# EasyEDA Pro project ProPrj_HTXStudio_OneHanded_Keyboard.epro, schematic 左手主控
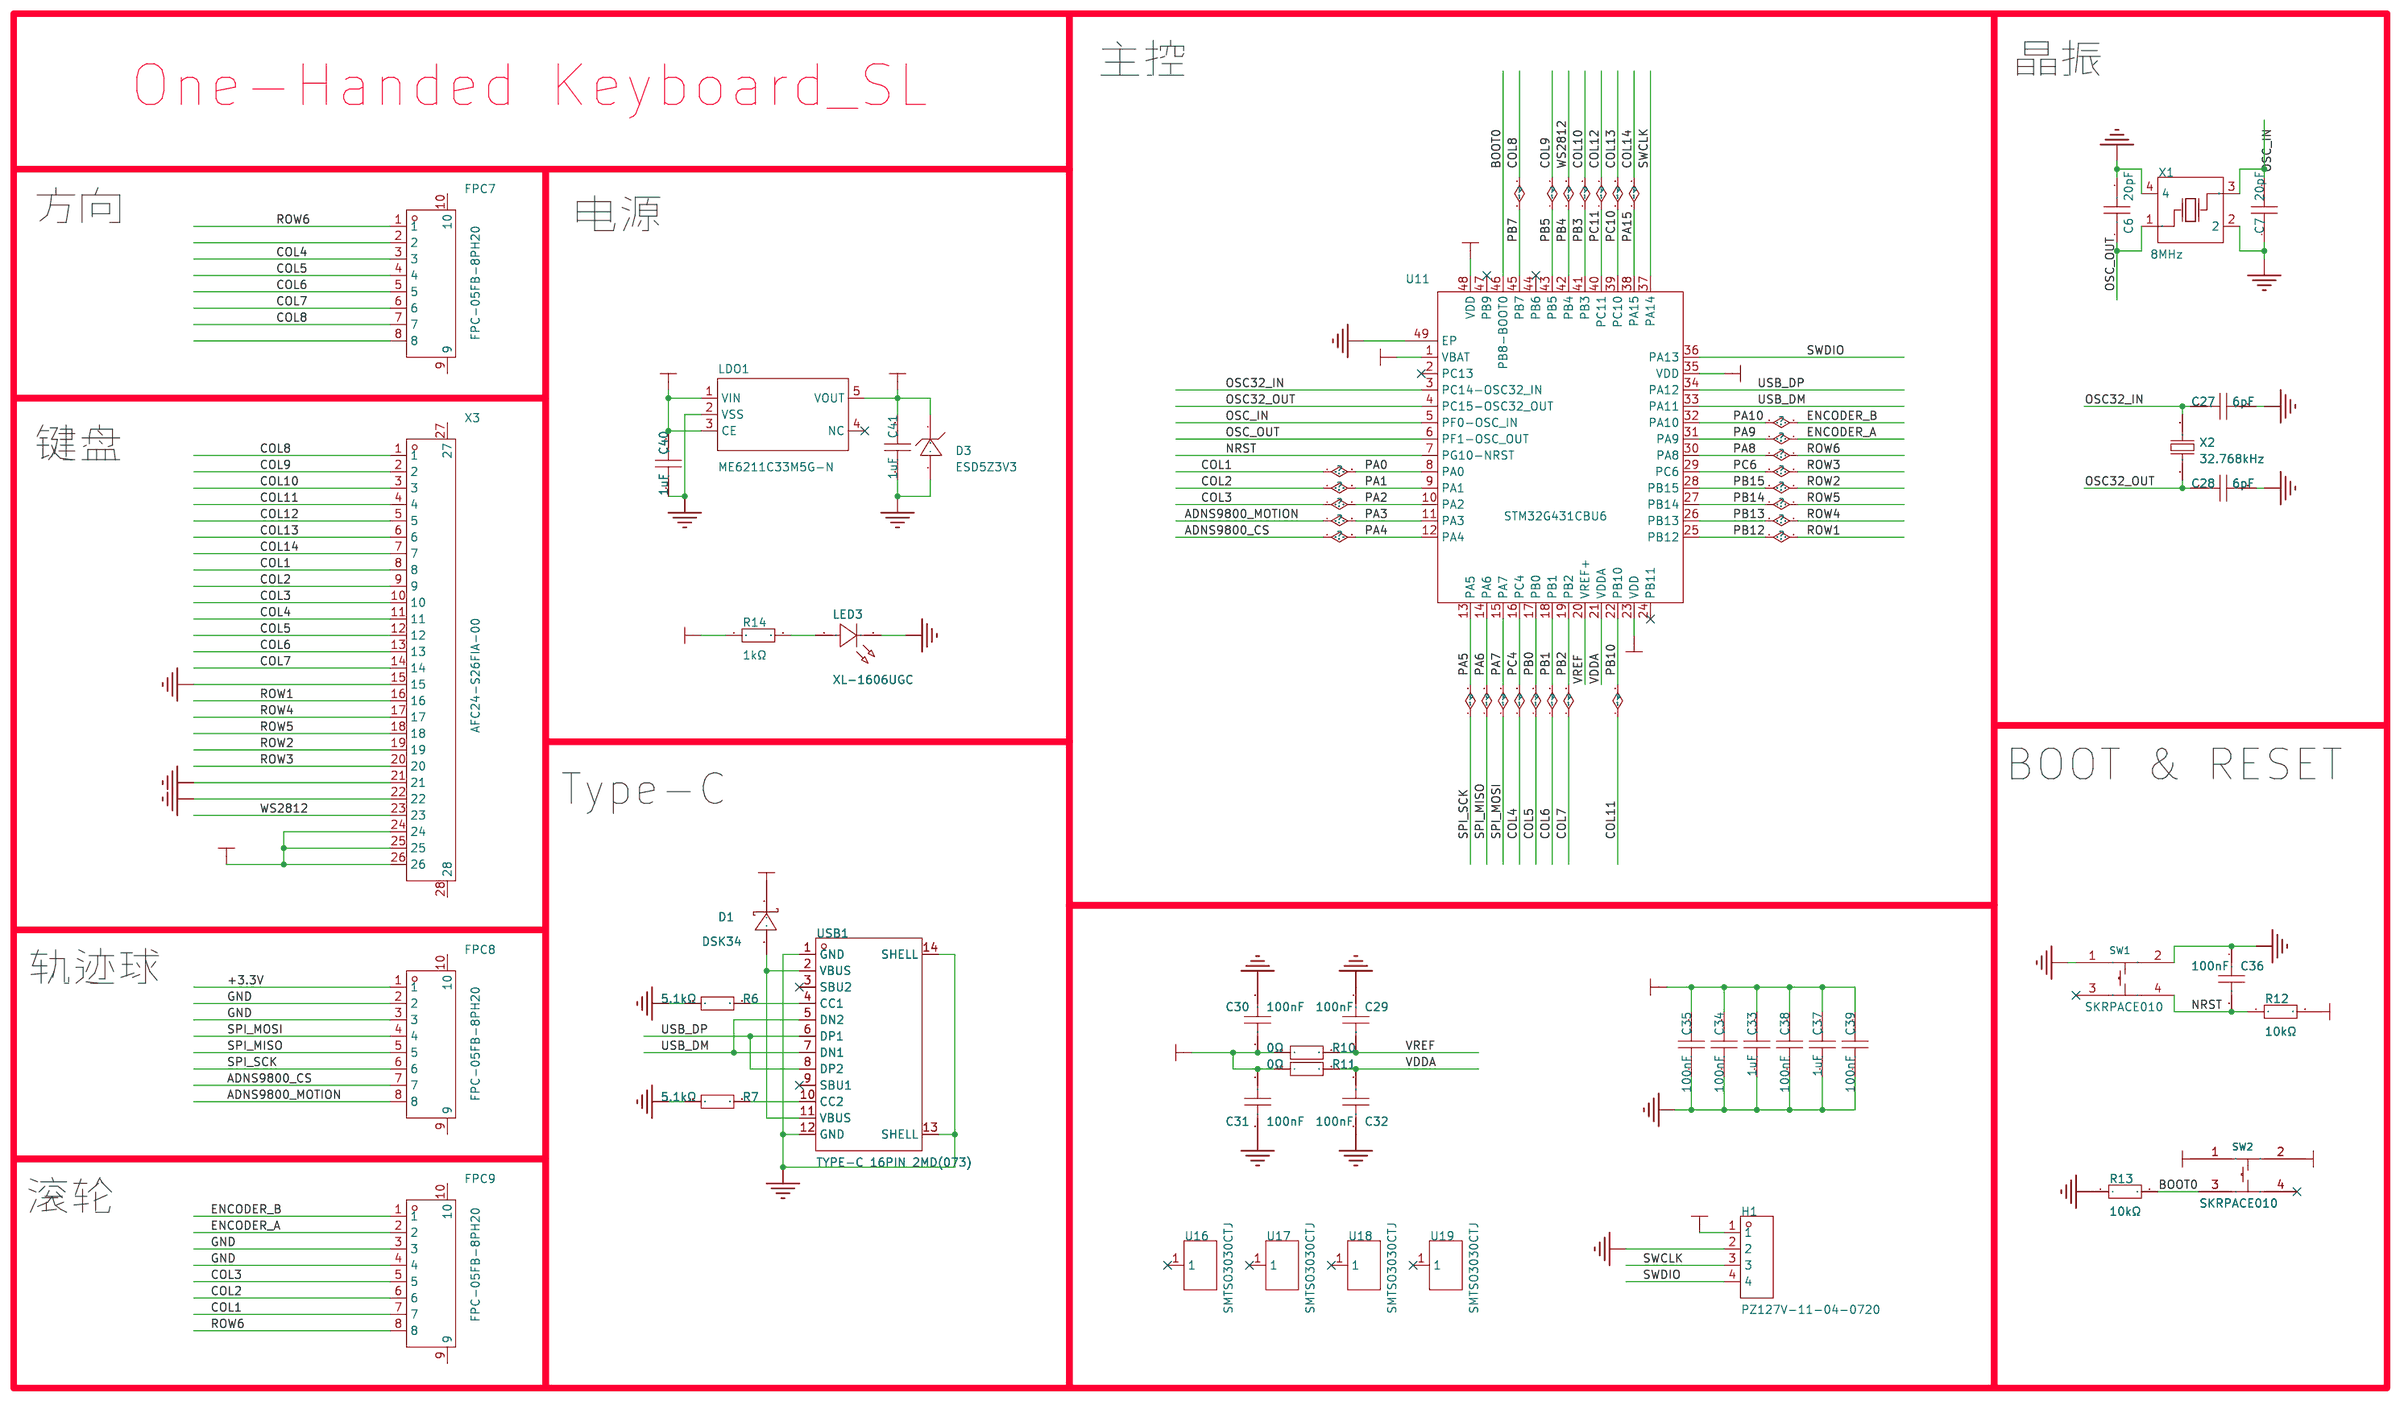
[diagram p1: schematic sheet]

## Parts
C6  20pF  [C0402]
C7  20pF  [C0402]
C27  6pF  [C0402]
C28  6pF  [C0402]
C29  100nF  [C0603]
C30  100nF  [C0603]
C31  100nF  [C0603]
C32  100nF  [C0603]
C33  1uF  [C0603]
C34  100nF  [C0603]
C35  100nF  [C0603]
C36  100nF  [C0603]
C37  1uF  [C0603]
C38  100nF  [C0603]
C39  100nF  [C0603]
C40  1uF  [C0603]
C41  1uF  [C0603]
D1  DSK34  [SOD-123_L2.8-W1.8-LS3.7-RD]
D3  ESD5Z3V3  [SOD-523_L1.2-W0.8-LS1.6-RD]
FPC7  FPC-05FB-8PH20  [FPC-SMD_8P-P0.50_XUNPU_FPC-05FB-8PH20]
FPC8  FPC-05FB-8PH20  [FPC-SMD_8P-P0.50_XUNPU_FPC-05FB-8PH20]
FPC9  FPC-05FB-8PH20  [FPC-SMD_8P-P0.50_XUNPU_FPC-05FB-8PH20]
H1  PZ127V-11-04-0720  [HDR-TH_4P-P1.27-V-M]
LDO1  ME6211C33M5G-N  [SOT-23-5_L3.0-W1.7-P0.95-LS2.8-BL]
LED3  XL-1606UGC  [LED-SMD_L1.7-W1.1-R-RD_GREEN]
R6  5.1kΩ  [R0402]
R7  5.1kΩ  [R0402]
R10  0Ω  [R0603]
R11  0Ω  [R0603]
R12  10kΩ  [R0603]
R13  10kΩ  [R0603]
R14  1kΩ  [R0603]
SW1  SKRPACE010  [KEY-SMD_4P-L4.2-W3.2-P2.20-LS4.6]
SW2  SKRPACE010  [KEY-SMD_4P-L4.2-W3.2-P2.20-LS4.6]
U11  STM32G431CBU6  [VQFN-48_L7.0-W7.0-P0.50-BL-EP5.5]
U16  SMTSO3030CTJ  [SMD_BD5.6-D4.1]
U17  SMTSO3030CTJ  [SMD_BD5.6-D4.1]
U18  SMTSO3030CTJ  [SMD_BD5.6-D4.1]
U19  SMTSO3030CTJ  [SMD_BD5.6-D4.1]
USB1  TYPE-C 16PIN 2MD(073)  [USB-C-SMD_TYPE-C-6PIN-2MD-073]
X1  8MHz  [OSC-SMD_4P-L2.5-W2.0-BL]
X2  32.768kHz  [FC-135R_L3.2-W1.5]
X3  AFC24-S26FIA-00  [FPC-SMD_AFC24-S26FIA]

## Library data of the parts
C6 C7 = GRM1555C1H200JA01D: 容值:20pF;精度:±5%;额定电压:50V;材质(温度系数):C0G;; LCSC Part Name: 20pF ±5% 50V; Supplier Part: C76959; Manufacturer: muRata(村田); Supplier Footprint: 0402; JLCPCB Part Class: 扩展库; Datasheet: https://atta.szlcsc.com/upload/public/pdf/source/20180307/C76959_15204091273971407747.pdf; Supplier: LCSC; Tolerance: ±5%; Voltage Rated: 50V; Temperature Coefficient: C0G
C27 C28 = GJM1555C1H6R0WB01D: 容值:6pF;额定电压:50V;材质(温度系数):C0G;; LCSC Part Name: 6pF 50V; Supplier Part: C882557; Manufacturer: muRata(村田); Supplier Footprint: 0402; JLCPCB Part Class: 扩展库; Datasheet: https://atta.szlcsc.com/upload/public/pdf/source/20201228/C882557_CC42579B2F91491CB41A68597C1310CF.pdf; Supplier: LCSC; Voltage Rated: 50V; Temperature Coefficient: C0G
C29-C32 C34-C36 C38 C39 = CC0603KRX7R9BB104: 容值:100nF;精度:±10%;额定电压:50V;材质(温度系数):X7R;; LCSC Part Name: 100nF ±10% 50V; Supplier Part: C14663; Manufacturer: YAGEO(国巨); Supplier Footprint: 0603; JLCPCB Part Class: 基础库; Datasheet: https://atta.szlcsc.com/upload/public/pdf/source/20180910/C282072_33301C7F631E79921B82A8DAC6BCC5B3.pdf; Supplier: LCSC; Tolerance: ±10%; Voltage Rated: 50V; Temperature Coefficient: X7R
C33 C37 C40 C41 = CL10A105KB8NNNC: 容值:1uF;精度:±10%;额定电压:50V;材质(温度系数):X5R;; LCSC Part Name: 1uF ±10% 50V; Supplier Part: C15849; Manufacturer: SAMSUNG(三星); Supplier Footprint: 0603; JLCPCB Part Class: 基础库; Datasheet: https://atta.szlcsc.com/upload/public/pdf/source/20160218/1457707763339.pdf; Supplier: LCSC; Tolerance: ±10%; Voltage Rated: 50V; Temperature Coefficient: X5R
D1 = DSK34_C41029: 二极管配置:独立式;正向压降(Vf):550mV@3A;直流反向耐压(Vr):40V;整流电流:3A;; LCSC Part Name: 电压:40V 电流:3A; Supplier Part: C41029; Manufacturer: MDD(辰达半导体); Supplier Footprint: SOD-123FL; JLCPCB Part Class: 扩展库; Datasheet: https://atta.szlcsc.com/upload/public/pdf/source/20230823/59DBCD4B265CD39EE1CF1649DFCCB71C.pdf; Supplier: LCSC; Diode Configuration: 独立式; Forward Voltage (Vf@If): 550mV@3A; Reverse Voltage (Vr): 40V; Rectified Current: 3A; Reverse Leakage Current (Ir): 500uA@40V
D3 = ESD5Z3V3_C2841409: +3.3V; Supplier Part: C2841409; Manufacturer: TECH PUBLIC(台舟); Supplier Footprint: SOD-523; JLCPCB Part Class: 扩展库; Datasheet: https://atta.szlcsc.com/upload/public/pdf/source/20211010/C2841409_E778AEF8B577E7561120661F012F3EB1.pdf; Supplier: LCSC; polarity: 单向; Reverse Stand-Off Voltage (Vrwm): +3.3V; Maximum Clamping Voltage: 14V; Breakdown Voltage: 5V; Reverse Leakage Current (Ir): 200nA; Number of Lines: 单路
FPC7-FPC9 = FPC-05FB-8PH20: 锁定特性:翻盖式;触点类型:双侧触点/上下接;触点数量:8P;间距:0.5mm;安装类型:卧贴;工作温度范围:-25℃~+85℃;; LCSC Part Name: 间距:0.5mm P数:8P 翻盖式 双侧触点/上下接; Supplier Part: C2856828; Manufacturer: XUNPU(讯普); Supplier Footprint: SMD,P=0.5mm,卧贴; JLCPCB Part Class: 扩展库; Datasheet: https://atta.szlcsc.com/upload/public/pdf/source/20210922/C2856828_96968FB666CC1781EEE4F204CBA73B0B.pdf; Supplier: LCSC; Locking Feature: 翻盖式; Contact Type: 双侧触点/上下接; Number of Contacts: 8P; Pitch: 0.5mm; Mounting Type: 卧贴; FFC, FCB Thickness: 0.3mm; Height Above Board: 2mm; Operating Temperature Range: -25℃~+85℃
H1 = PZ127V-11-04-0720: 插针结构:1x4P;间距:1.27mm;行距:-;圆针/方针:-;安装类型:直插;排数:单排;总PIN位数:4P;额定电流:-;额定电压:-;配合针长度:3.9mm;塑高:1mm;端接针长度:2.3mm;触头材质:黄铜;触头镀层:-;工作温度范围:-40℃~+105℃;焊接温度(最大值):-;颜色:黑色;; LCSC Part Name: 间距:1.27mm 1x4P 直插; Supplier Part: C541879; Manufacturer: XFCN(兴飞); Supplier Footprint: 插件,P=1.27mm; JLCPCB Part Class: 扩展库; Datasheet: https://atta.szlcsc.com/upload/public/pdf/source/20200519/C541879_5CD99C402ABEE613587AE88FBA356357.pdf; Supplier: LCSC; Pin Structure: 1x4P; Pitch: 1.27mm; Mounting Type: 直插; Number of Rows: 单排; Number of Pins: 4P; Length of Mating Pin: 3.9mm; Insulation Height: 1mm; Length of End Connection Pin: 2.3mm; Contact Material: 黄铜; Operating Temperature Range: -40℃~+105℃; Color: 黑色
LDO1 = ME6211C33M5G-N: 输出类型:固定;工作电压:6V;输出电压:3.3V;输出电流:500mA;电源纹波抑制比(PSRR):70dB@(1kHz)；62dB@(10kHz);输出极性:正极;; LCSC Part Name: 输入6V 输出3.3V 500mA; Supplier Part: C82942; Manufacturer: MICRONE(南京微盟); Supplier Footprint: SOT-23-5; JLCPCB Part Class: 扩展库; Datasheet: https://atta.szlcsc.com/upload/public/pdf/source/20170918/C82942_1505727073070976520.pdf; Supplier: LCSC; Output Type: 固定; Voltage - Supply: 6V; Output Voltage: 3.3V; Output Current: 500mA; Power Supply Rejection Ratio (PSRR): 70dB@(1kHz)；62dB@(10kHz); Voltage Dropout: 260mV@(200mA); Features: 短路保护(SCP)；低ESR；过流保护(OCP)；带使能; Output Configuration: 正极; Number of Outputs: 1
LED3 = XL-1606UGC: 发光颜色:翠绿色;功率:80mW;正向电流:25mA;主波长:520nm~530nm;透镜颜色:无色透明透镜;色温:-;发光角度:120°;载带方式:侧贴;工作温度:-30℃~+85℃;; Supplier Part: C965863; Manufacturer: XINGLIGHT(成兴光); Supplier Footprint: SMD,1.1x1.7mm; JLCPCB Part Class: 扩展库; Datasheet: https://atta.szlcsc.com/upload/public/pdf/source/20221102/94FA3AB05D9E652787BBD0AFAAE97065.pdf; Supplier: LCSC; Emitted Color: 翠绿色; Power Dissipation: 80mW; Forward Current: 25mA; Dominant Wavelength: 520nm~530nm; Peak Wavelength: 535nm; Lens Color: 无色透明透镜; Viewing Angle: 120°; Mounting Sytle: 侧贴; Operating Temperature: -30℃~+85℃
R6 R7 = 0402WGF5101TCE: 电阻类型:厚膜电阻;阻值:5.1kΩ;精度:±1%;功率:62.5mW;最大工作电压:50V;温度系数:±100ppm/℃;; LCSC Part Name: 5.1kΩ ±1% 62.5mW 厚膜电阻; Supplier Part: C25905; Manufacturer: UNI-ROYAL(厚声); Supplier Footprint: 0402; JLCPCB Part Class: 基础库; Datasheet: https://atta.szlcsc.com/upload/public/pdf/source/20200306/C422600_1E6D84923E4A46A82E41ADD87F860B5C.pdf; Supplier: LCSC; Type: 厚膜电阻; Tolerance: ±1%; Power(Watts): 62.5mW; Overload Voltage (Max): 50V; Temperature Coefficient: ±100ppm/℃; Operating Temperature Range: -55℃~+155℃
R10 R11 = 0603WAF0000T5E: 电阻类型:厚膜电阻;阻值:0Ω;精度:±1%;功率:100mW;最大工作电压:75V;; LCSC Part Name: 0Ω ±1% 100mW 厚膜电阻; Supplier Part: C21189; Manufacturer: UNI-ROYAL(厚声); Supplier Footprint: 0603; JLCPCB Part Class: 基础库; Datasheet: https://atta.szlcsc.com/upload/public/pdf/source/20200306/C422600_1E6D84923E4A46A82E41ADD87F860B5C.pdf; Supplier: LCSC; Type: 厚膜电阻; Tolerance: ±1%; Power(Watts): 100mW; Overload Voltage (Max): 75V; Operating Temperature Range: -55℃~+155℃
R12 R13 = 0603WAF1002T5E: 电阻类型:厚膜电阻;阻值:10kΩ;精度:±1%;功率:100mW;最大工作电压:75V;温度系数:±100ppm/℃;; LCSC Part Name: 厚膜电阻 10kΩ ±1% 100mW; Supplier Part: C25804; Manufacturer: UNI-ROYAL(厚声); Supplier Footprint: 0603; JLCPCB Part Class: 基础库; Datasheet: https://atta.szlcsc.com/upload/public/pdf/source/20200306/C422600_1E6D84923E4A46A82E41ADD87F860B5C.pdf; Supplier: LCSC; Type: 厚膜电阻; Tolerance: ±1%; Power(Watts): 100mW; Overload Voltage (Max): 75V; Temperature Coefficient: ±100ppm/℃; Operating Temperature Range: -55℃~+155℃
R14 = 0603WAF1001T5E: 电阻类型:厚膜电阻;阻值:1kΩ;精度:±1%;功率:100mW;最大工作电压:75V;温度系数:±100ppm/℃;; LCSC Part Name: 1kΩ ±1% 100mW 厚膜电阻; Supplier Part: C21190; Manufacturer: UNI-ROYAL(厚声); Supplier Footprint: 0603; JLCPCB Part Class: 基础库; Datasheet: https://atta.szlcsc.com/upload/public/pdf/source/20200306/C422600_1E6D84923E4A46A82E41ADD87F860B5C.pdf; Supplier: LCSC; Type: 厚膜电阻; Tolerance: ±1%; Power(Watts): 100mW; Overload Voltage (Max): 75V; Temperature Coefficient: ±100ppm/℃; Operating Temperature Range: -55℃~+155℃
SW1 SW2 = SKRPACE010: 电路结构:单刀单掷;按钮形状:椭圆形按钮;安装方式:立贴;开关长度:4.2mm;开关宽度:3.2mm;开关高度:2.5mm;触点电流:50mA;额定电压(DC):16V;带灯:-;机械寿命:-;; LCSC Part Name: 4.2*3.2*2.5mm 立贴 轻触开关; Supplier Part: C139797; Manufacturer: ALPSALPINE(阿尔卑斯阿尔派); Supplier Footprint: SMD; JLCPCB Part Class: 扩展库; Datasheet: https://atta.szlcsc.com/upload/public/pdf/source/20171113/C139797_15105612676371115729.pdf; Supplier: LCSC; Circuit: 单刀单掷; Actuator Style: 椭圆形按钮; Mounting Style: 立贴; Switch Length: 4.2mm; Switch Width: 3.2mm; Switch Height: 2.5mm; Contact Current: 50mA; Voltage Rating (DC): 16V
U11 = STM32G431CBU6: CPU内核:ARM-M系列;CPU最大主频:170MHz;应用领域:-;; LCSC Part Name: 带DSP和FPU的170MHz主流ARM Cortex-M4 MCU，具有128 KB Flash存储器、数学加速器和中等模拟电平集成; Supplier Part: C529356; Manufacturer: ST(意法半导体); Supplier Footprint: UFQFPN-48(7x7); JLCPCB Part Class: Extended Part; Datasheet: https://atta.szlcsc.com/upload/public/pdf/source/20200511/C529354_7C66CF00837B904D0C15DCE45B69418C.pdf; Supplier: LCSC; CPU Core: ARM-M系列; CPU Maximum Speed: 170MHz; Program Storage Size: 128KB; Program Memory Type: FLASH; Number of I/O: 42; ADC (Bit): 12bit; DAC (Bit): 12bit; Low Voltage Detection Threshold: 1.71V~3.6V
U16-U19 = SMTSO3030CTJ: M3x5.56xL3+1.53; LCSC Part Name: 雄和远景，电路板表贴圆螺母柱，M3X3，铜镀锡,1个; Supplier Part: C2915308; Manufacturer: Sinhoo(雄和远景); JLCPCB Part Class: 扩展库; Datasheet: https://atta.szlcsc.com/upload/public/pdf/source/20211122/17CF5E24EB4D4DC090A80DE3D7DE5E21.pdf; Supplier: LCSC; specifications: M3X3; surface treatment: 镀锡
USB1 = TYPE-C 16PIN 2MD(073): 连接器类型:Type-C;标准:USB 3.1;公母:母;安装方式:卧贴;触点数量:16P;端口数量:1;额定电流 - 电源:5A;工作温度范围:-25℃~+85℃;; LCSC Part Name: Type-C 母 卧贴; Supplier Part: C2765186; Manufacturer: SHOU HAN(首韩); Supplier Footprint: SMD; JLCPCB Part Class: 扩展库; Datasheet: https://atta.szlcsc.com/upload/public/pdf/source/20211123/39B17C16241EAC15C5E277BDA434118E.pdf; Supplier: LCSC; Connector Type: Type-C; Standard: USB 3.1; Gender: 母; Mounting Style: 卧贴; Number of Contacts: 16P; Number of Ports: 1; Current Rating - Power (Max): 5A; Operating Temperature Range: -25℃~+85℃; Rated Voltage (Max): 5V; Connect-Disconnect Life: 5千次; Core Colour: 黑色
X1 = TXM12M0004252FBCEO00T: 晶振类型:贴片晶振;频率:12MHz;常温频差:±10ppm;外接负载电容:12pF;频率稳定度(全温):±30ppm;; LCSC Part Name: 12MHz ±10ppm 12pF; Supplier Part: C284155; Manufacturer: YJX(雅晶鑫); Supplier Footprint: SMD2520-4P; JLCPCB Part Class: 扩展库; Datasheet: https://atta.szlcsc.com/upload/public/pdf/source/20180910/C284155_B9AC3CB548367C19CE747B551130DB15.pdf; Supplier: LCSC; Crystal Type: 贴片晶振; Normal temperature Frequency Tolerance: ±10ppm; External load capacitor: 12pF; Frequency Stability(Full temperature range): ±30ppm; Equivalent Series Resistance (ESR): 120Ω; Operating Temperature: -40℃~+85℃
X2 = Q13FC13500004_C32346: 晶振类型:贴片晶振;频率:32.768kHz;常温频差:±20ppm;负载电容:12.5pF;; LCSC Part Name: 32.768kHz ±20ppm 12.5pF; Supplier Part: C32346; Manufacturer: EPSON(爱普生); Manufacturer Part: Q13FC13500004; Supplier Footprint: SMD3215-2P; JLCPCB Part Class: 基础库; Datasheet: https://atta.szlcsc.com/upload/public/pdf/source/20240418/0E0FF5F0356BA3753F616001439D1416.pdf; Supplier: LCSC; Crystal Type: 贴片晶振; Normal temperature Frequency Tolerance: ±20ppm; Load Capacitor: 12.5pF; Equivalent Series Resistance (ESR): 70kΩ; Operating Temperature: -40℃~+85℃
X3 = AFC24-S26FIA-00: 锁定特性:翻盖式;触点类型:双侧触点/上下接;触点数量:26P;间距:0.5mm;安装类型:卧贴;工作温度范围:-;; LCSC Part Name: 间距:0.5mm P数:26P 翻盖式 双侧触点/上下接; Supplier Part: C262684; Manufacturer: JS(钜硕电子); Supplier Footprint: SMD,P=0.5mm,卧贴; JLCPCB Part Class: 扩展库; Datasheet: https://atta.szlcsc.com/upload/public/pdf/source/20201020/C262682_4418ACDA99370B54C7579F9B07EB16A1.pdf; Supplier: LCSC; Locking Feature: 翻盖式; Contact Type: 双侧触点/上下接; Number of Contacts: 26P; Pitch: 0.5mm; Mounting Type: 卧贴; FFC, FCB Thickness: 0.3mm; Height Above Board: 2mm

## Nets
+3.3V: C30.1 C31.2 C33.2 C34.2 C35.2 C37.2 C38.2 C39.2 C41.2 D3.1(C) FPC8.1 H1.1 LDO1.5(VOUT) R10.1 R11.1 R12.2 R14.1 SW2.1 SW2.2 U11.1(VBAT) U11.23(VDD) U11.35(VDD) U11.48(VDD)
GND: C6.2 C7.1 C27.2 C28.2 C29.1 C30.2 C31.1 C32.2 C33.1 C34.1 C35.1 C36.1 C37.1 C38.1 C39.1 C40.1 C41.1 D3.2(A) FPC8.2 FPC8.3 FPC9.3 FPC9.4 H1.2 LDO1.2(VSS) LED3.2(K) R6.1 R7.1 R13.1 SW1.1 SW1.2 U11.49(EP) USB1.1(GND) USB1.12(GND) USB1.13(SHELL) USB1.14(SHELL) X1.2 X1.4 X3.15 X3.21 X3.22
VBUS: C40.2 D1.1(K) LDO1.1(VIN) LDO1.3(CE) X3.24 X3.25 X3.26
VDDA: C32.1 R11.2 U11.21(VDDA)
ADNS9800_CS: FPC8.7 U11.12(PA4)
ADNS9800_MOTION: FPC8.8 U11.11(PA3)
BOOT0: R13.2 SW2.3 U11.46(PB8-BOOT0)
COL1: FPC9.7 U11.8(PA0) X3.8
COL2: FPC9.6 U11.9(PA1) X3.9
COL3: FPC9.5 U11.10(PA2) X3.10
COL4: FPC7.3 U11.16(PC4) X3.11
COL5: FPC7.4 U11.17(PB0) X3.12
COL6: FPC7.5 U11.18(PB1) X3.13
COL7: FPC7.6 U11.19(PB2) X3.14
COL8: FPC7.7 U11.45(PB7) X3.1
COL9: U11.43(PB5) X3.2
COL10: U11.41(PB3) X3.3
COL11: U11.22(PB10) X3.4
COL12: U11.40(PC11) X3.5
COL13: U11.39(PC10) X3.6
COL14: U11.38(PA15) X3.7
ENCODER_A: FPC9.2 U11.31(PA9)
ENCODER_B: FPC9.1 U11.32(PA10)
NRST: C36.2 R12.1 SW1.4 U11.7(PG10-NRST)
OSC32_IN: C27.1 U11.3(PC14-OSC32_IN) X2.2
OSC32_OUT: C28.1 U11.4(PC15-OSC32_OUT) X2.1
OSC_IN: C7.2 U11.5(PF0-OSC_IN) X1.3(OSC2)
OSC_OUT: C6.1 U11.6(PF1-OSC_OUT) X1.1(OSC1)
PA5: FPC8.6 U11.13(PA5)
PA6: FPC8.5 U11.14(PA6)
PA7: FPC8.4 U11.15(PA7)
PA8: FPC7.1 FPC9.8 U11.30(PA8)
PB4: U11.42(PB4) X3.23
PB12: U11.25(PB12) X3.16
PB13: U11.26(PB13) X3.17
PB14: U11.27(PB14) X3.18
PB15: U11.28(PB15) X3.19
PC6: U11.29(PC6) X3.20
SWCLK: H1.3 U11.37(PA14)
SWDIO: H1.4 U11.36(PA13)
USB_DM: U11.33(PA11) USB1.5(DN2) USB1.7(DN1)
USB_DP: U11.34(PA12) USB1.6(DP1) USB1.8(DP2)
VREF: C29.2 R10.2 U11.20(VREF+)
$1N2982: R6.2 USB1.4(CC1)
$1N2983: R7.2 USB1.10(CC2)
$1N2991: D1.2(A) USB1.2(VBUS) USB1.11(VBUS)
$1N3210: LED3.1(A) R14.2

Not connected (* = marked no-connect by the designer): FPC7 2 8 9 10; FPC8 9 10; FPC9 9 10; LDO1 4(NC)*; SW1 3*; SW2 4*; U11 2(PC13)* 24(PB11)* 44(PB6)* 47(PB9)*; U16 1*; U17 1*; U18 1*; U19 1*; USB1 3(SBU2)* 9(SBU1)*; X3 27 28

## Notes on the sheet
- 主控
- 晶振
- One-Handed Keyboard_SL
- 方向
- 电源
- 键盘
- BOOT & RESET
- Type-C
- 轨迹球
- 滚轮
